# Altium schematic sheet SDRAM.SchDoc
size 420 x 297 mm; Date: 22.03.2024; ApprovedBy: Arda B.; CheckedBy: Arda B.; DrawnBy: Arda Bozkurt; Revision: 001; SheetNumber: 5; SheetTotal: 9; Size: A3; Department: HDD; DOC_NO_ASSY_: __; Time: 22.03.2024
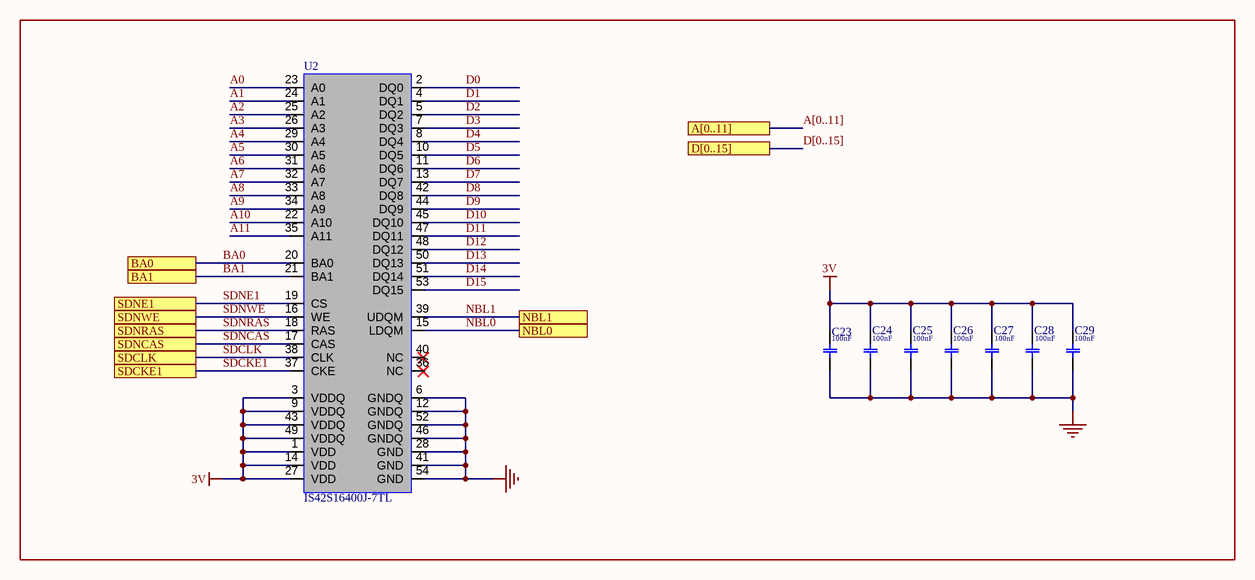
[diagram p0: SDRAM.SchDoc]

## Parts
C23  value 100nF  [CAP-0402]  (hidden comment: CC0402KRX7R7BB104)
C24  value 100nF  [CAP-0402]  (hidden comment: CC0402KRX7R7BB104)
C25  value 100nF  [CAP-0402]  (hidden comment: CC0402KRX7R7BB104)
C26  value 100nF  [CAP-0402]  (hidden comment: CC0402KRX7R7BB104)
C27  value 100nF  [CAP-0402]  (hidden comment: CC0402KRX7R7BB104)
C28  value 100nF  [CAP-0402]  (hidden comment: CC0402KRX7R7BB104)
C29  value 100nF  [CAP-0402]  (hidden comment: CC0402KRX7R7BB104)
U2  IS42S16400J-7TL  [54-TSOP]

## Ports
A[0..11] (see TOP[3A], Micro Controller[4B]), BA0 (see TOP[3A], Micro Controller[5A]), BA1 (see TOP[3A], Micro Controller[5A]), D[0..15] (see TOP[3A], Micro Controller[4B]), NBL0 (see TOP[3A], Micro Controller[5A]), NBL1 (see TOP[3A], Micro Controller[5A]), SDCKE1 (see TOP[3A], Micro Controller[5A]), SDCLK (see TOP[3A], Micro Controller[5A]), SDNCAS (see TOP[3A], Micro Controller[5A]), SDNE1 (see TOP[3A], Micro Controller[5A]), SDNRAS (see TOP[3A], Micro Controller[5A]), SDNWE (see TOP[3A], Micro Controller[5A])

## Nets
3V: C23.2 C24.2 C25.2 C26.2 C27.2 C28.2 C29.2 U2.1(VDD) U2.3(VDDQ) U2.9(VDDQ) U2.14(VDD) U2.27(VDD) U2.43(VDDQ) U2.49(VDDQ)
GND: C23.1 C24.1 C25.1 C26.1 C27.1 C28.1 C29.1 U2.6(GNDQ) U2.12(GNDQ) U2.28(GND) U2.41(GND) U2.46(GNDQ) U2.52(GNDQ) U2.54(GND)
A0: U2.23(A0)
A1: U2.24(A1)
A2: U2.25(A2)
A3: U2.26(A3)
A4: U2.29(A4)
A5: U2.30(A5)
A6: U2.31(A6)
A7: U2.32(A7)
A8: U2.33(A8)
A9: U2.34(A9)
A10: U2.22(A10)
A11: U2.35(A11)
BA0: U2.20(BA0) ; port BA0
BA1: U2.21(BA1) ; port BA1
D0: U2.2(DQ0)
D1: U2.4(DQ1)
D2: U2.5(DQ2)
D3: U2.7(DQ3)
D4: U2.8(DQ4)
D5: U2.10(DQ5)
D6: U2.11(DQ6)
D7: U2.13(DQ7)
D8: U2.42(DQ8)
D9: U2.44(DQ9)
D10: U2.45(DQ10)
D11: U2.47(DQ11)
D12: U2.48(DQ12)
D13: U2.50(DQ13)
D14: U2.51(DQ14)
D15: U2.53(DQ15)
NBL0: U2.15(LDQM) ; port NBL0
NBL1: U2.39(UDQM) ; port NBL1
SDCKE1: U2.37(CKE) ; port SDCKE1
SDCLK: U2.38(CLK) ; port SDCLK
SDNCAS: U2.17(CAS) ; port SDNCAS
SDNE1: U2.19(CS) ; port SDNE1
SDNRAS: U2.18(RAS) ; port SDNRAS
SDNWE: U2.16(WE) ; port SDNWE

Not connected (* = marked no-connect by the designer): U2 36(NC) 40(NC)

## Buses and harness runs
bus A[0..11] = port A[0..11]
bus D[0..15] = port D[0..15]

## Notes on the sheet
- REVİSİON
- DESCRIPTION
- DATE
- APPROVED
- DWG NO:
- TAINIM/DESCRIPTION
- REV:
- DOSYA ADI/FİLE NAME
- HAZIRLAYAN/PREPARED BY
- KONTROL EDEN/ CHECKED BY
- YAYIN TARİHİ/REL. DATE
- DEĞ TARİHİ/CHANCE DATE
- ONAYLAYAN/APPROVED BY
- REVİZYON/REVISION
- Arda Bozkurt
- BÖLÜM/DEPARTMENT
- BOYUT/SİZE
- SAYFA/SHEET
- of

## Library data of the parts
C23-C29 = CAP CER 100nF 16V X7R 0402: Multilayer Ceramic Capacitor, 0.1 uF, 25 V, ± 10%, X7R, 0402 [1005 Metric]; Manufacturer: Yageo; Material: 4241ConductorMaterial; Voltage Rating: 16V; Temperature Coefficient: 30ppm/°C; Supplier: Future Electronics; Supplier Part Number: 8517856; Manufacturer Part Number: CC0402KRX7R7BB104; RoHS: Yes; Category: Ceramic Capacitors; Stock: 30330000; Pricing: 10000=0,0028, 40000=0,0027, 150000=0,0025, 300000=0,0025, 750000=0,0023 (USD); Mounting Technology: Surface Mount; Case/Package: 0402; Pins: 2; Case Code (Metric): 1005; Case Code (Imperial): 0402; Min Operating Temperature: -55°C; Max Operating Temperature: 125°C; Tolerance: 10%; Dielectric: X7R; Voltage Rating (DC): 16V; Packaging: Tape and Reel; Package Quantity: 1; Termination: SMD/SMT; Voltage: 16V; Series: CC; Voltage Rating (AC): 16V; Length: 1mm; Width: 0.02inch; Height: 0.5mm; Thickness: 0.022inch; Depth: 0.5mm; Radiation Hardening: No; RoHS Compliant: Yes; Reach SVHC Compliant: No; Halogen Free: 5694HalogenFree; Lead Free: 5697LeadFree; ComponentLink1URL: https://datasheet.ciiva.com/11788/0900766b80ce67ed-11788364.pdf?src-supplier=Rs; ComponentLink1Description: https://datasheet.ciiva.com/11788/0900766b80ce67ed-11788364.pdf?src-supplier=Rs; ComponentLink2URL: https://datasheet.ciiva.com/7978/1489800-7978111.pdf?src-supplier=Element14; ComponentLink2Description: https://datasheet.ciiva.com/7978/1489800-7978111.pdf?src-supplier=Element14; ComponentLink3URL: https://datasheet.ciiva.com/161/mlccorderingcode-161545.pdf?src-supplier=Digikey; ComponentLink3Description: https://datasheet.ciiva.com/161/mlccorderingcode-161545.pdf?src-supplier=Digikey; ComponentLink4URL: https://datasheet.ciiva.com/161/mlccorderingcode-161544.pdf?src-supplier=Digikey; ComponentLink4Description: https://datasheet.ciiva.com/161/mlccorderingcode-161544.pdf?src-supplier=Digikey; ComponentLink5URL: https://datasheet.ciiva.com/161/mlccorderingcode-161546.pdf?src-supplier=Digikey; ComponentLink5Description: https://datasheet.ciiva.com/161/mlccorderingcode-161546.pdf?src-supplier=Digikey; ComponentLink6URL: https://datasheet.ciiva.com/8033/1734573-8033661.pdf?src-supplier=Element14; ComponentLink6Description: https://datasheet.ciiva.com/8033/1734573-8033661.pdf?src-supplier=Element14; ComponentLink7URL: https://datasheet.ciiva.com/11587/upy-gphc-x7r-6-3v-to-50v-8-11587305.pdf?src-supplier=Avnet; ComponentLink7Description: https://datasheet.ciiva.com/11587/upy-gphc-x7r-6-3v-to-50v-8-11587305.pdf?src-supplier=Avnet; ComponentLink8URL: https://datasheet.ciiva.com/28450/1489800-28450335.pdf?src-supplier=Element14; ComponentLink8Description: https://datasheet.ciiva.com/28450/1489800-28450335.pdf?src-supplier=Element14; ComponentLink9URL: https://datasheet.ciiva.com/13395/upy-gphc-x7r-6-3v-to-50v-8-13395676.pdf?src-supplier=Mouser; ComponentLink9Description: https://datasheet.ciiva.com/13395/upy-gphc-x7r-6-3v-to-50v-8-13395676.pdf?src-supplier=Mouser; ComponentLink10URL: https://datasheet.ciiva.com/8033/1734573-8033663.pdf?src-supplier=Element14; ComponentLink10Description: https://datasheet.ciiva.com/8033/1734573-8033663.pdf?src-supplier=Element14
U2 = IC DRAM 64MBIT PAR 54TSOP II: PTC Resettable Fuse 2A(hold) 4A(trip) 16VDC 100A 1.5W 4.5s 0.035Ohm SMD Solder Pad 7.98 X 5.44 X 0.9mm T/R; Manufacturer: Bel; Manufacturer Part Number: 0ZCF0200AF2C; Time to Trip: 5s; Voltage Rating: 24V; Supplier: Mouser; Supplier Part Number: 530-0ZCF0200AF2C; RoHS: Yes; Category: PTC Resettable Fuses; Stock: 47794; Pricing: 1=0,27, 10=0,222, 50=0,222, 100=0,198, 1000=0,166, 10000=0,113 (USD); Mounting Technology: Surface Mount; Case/Package: 448Case; Case Code (Metric): 7351; Case Code (Imperial): 2920; Min Operating Temperature: -40°C; Max Operating Temperature: 85°C; Packaging: Cut Tape; Series: 0ZCF; Max Current Rating: 100A; Hold Current: 2A; Trip Current: 4A; Current Rating: 100A; Height: 800um; RoHS Compliant: Yes; Lead Free: Lead Free; ComponentLink1URL: https://datasheet.ciiva.com/18550/0zcf-18550655.pdf?src-supplier=Digikey; ComponentLink1Description: https://datasheet.ciiva.com/18550/0zcf-18550655.pdf?src-supplier=Digikey